# EAGLE schematic 2_no_signals (EAGLE 6.5.0)
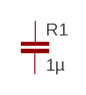
[diagram p0: schematic, sheet 1]

## Parts
R1  1µ  C-EU025-024X044  [C025-024X044]
Unconnected: R1.1 R1.2

## Library data of the parts
R1 = rcl:C-EU: CAPACITOR, European symbol